# Altium schematic sheet ES2J1_Group9_Schematic.schdoc
size 297 x 209 mm; Symbol: Drawing-Symbol_A4; Company: 嘉立创EDA; Drawed: Boyu_Zhang_Bob; Reviewed: Boyu_Zhang_Bob; Part Number: u5617438; Version: V1.0; Page Size: A4; @Project Name: ES2J1_EEE; @Update Date: 2026-02-16; @Create Date: 2026-02-16; Device: Drawing-Symbol_A4; @Board Name: Board1; @Page Name: P1; @Create Time: 23:46:07; @Page Count: 1; @Page No: 1; @Schematic Name: Schematic1; @Update Time: 23:46:07; @Assembly Variant: Basic; Border: 1; Title Block Position: 3; Size: A4; Width: 1170; Height: 825; Region Start: 1; X Region Count: 6; Y Region Count: 4; Blade Width: 10; Title Block: 1; SheetNumber: 1; SheetTotal: 1
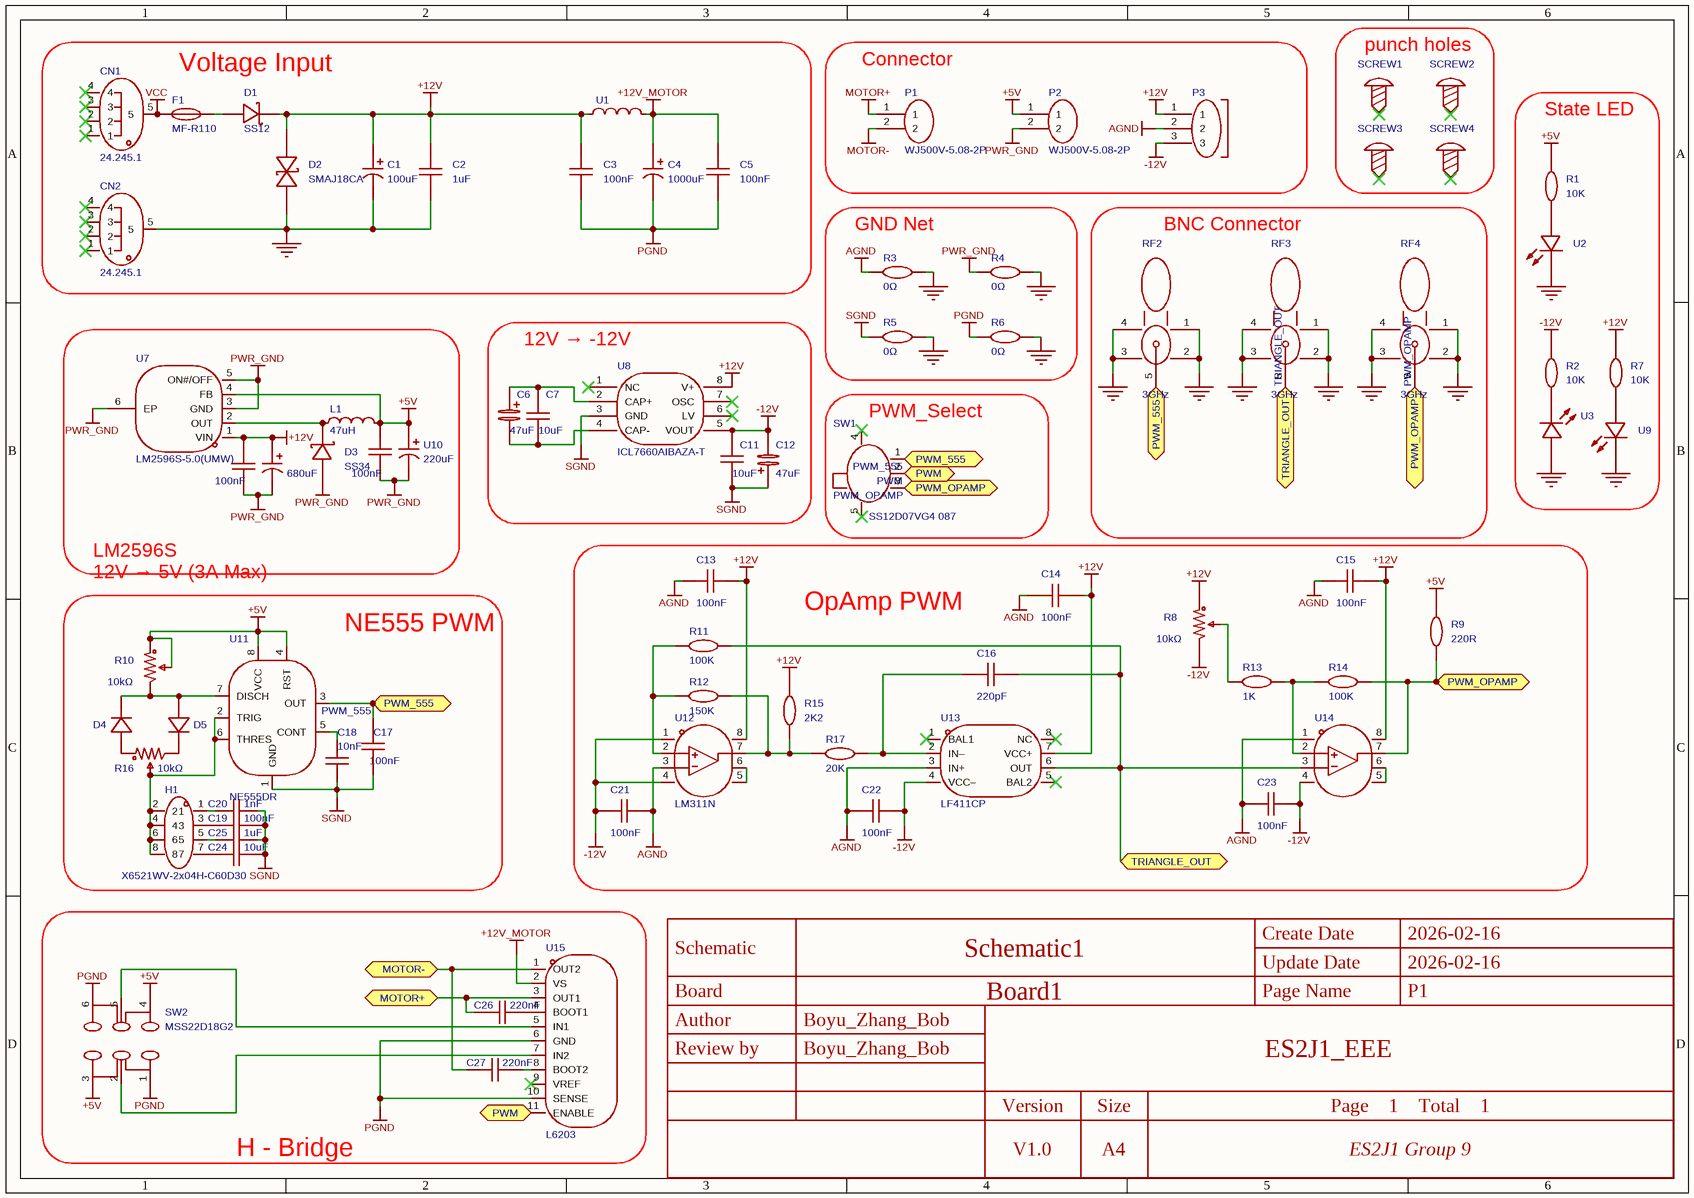
[diagram p0: ES2J1_Group9_Schematic.schdoc]

## Parts
C1  100uF  [CAP-TH_BD8.0-P3.50-D0.6-FD]
C2  1uF  [C1206]
C3  100nF  [C0805]
C4  1000uF  [CAP-TH_BD13.0-P5.00-D0.6-FD]
C5  100nF  [C0805]
C6  47uF  [CAP-SMD_L3.5-W2.8-R-RD]
C7  10uF  [C0603]
C8  100nF  [C0603]
C9  100nF  [C0603]
C10  680uF  [CAP-SMD_BD10.0-L10.3-W10.3-LS10.9-FD]
C11  10uF  [C0603]
C12  47uF  [CAP-SMD_L3.5-W2.8-R-RD]
C13  100nF  [C0603]
C14  100nF  [C0603]
C15  100nF  [C0603]
C16  220pF  [C0603]
C17  100nF  [C0603]
C18  10nF  [C0603]
C19  100nF  [C0603]
C20  1nF  [C0603]
C21  100nF  [C0603]
C22  100nF  [C0603]
C23  100nF  [C0603]
C24  10uF  [C0603]
C25  value 1uF  [C0603]
C26  220nF  [C0603]
C27  220nF  [C0603]
CN1  24.245.1  [ANT-TH_L33.0-W12.0_RED]
CN2  24.245.1  [ANT-TH_L33.0-W12.0_RED]
D1  SS12  [SMA_L4.3-W2.6-LS5.2-RD]
D2  SMAJ18CA  [SMA_L4.4-W2.6-LS5.0-BI]
D3  SS34  [SMA_L4.3-W2.6-LS5.2-RD]
D4  LL4148-MS  [LL-34_L3.5-W1.5-RD]  (value not drawn)
D5  LL4148-MS  [LL-34_L3.5-W1.5-RD]  (value not drawn)
F1  MF-R110  [FUSE-TH_L9.5-W3.5-P5.08-D0.8-S1.2]
H1  X6521WV-2x04H-C60D30  [HDR-TH_8P-P2.54-V-M-R2-C4-S2.54]
L1  47uH  [IND-SMD_L7.0-W6.6_FXL0630]
P1  WJ500V-5.08-2P  [CONN-TH_2P-P5.00_WJ500V-5.08-2P]
P2  WJ500V-5.08-2P  [CONN-TH_2P-P5.00_WJ500V-5.08-2P]
P3  WJ500V-5.08-03P-14-00A  [CONN-TH_3P-P5.00_WJ500V-5.08-3P]  (value not drawn)
R1  10K  [R0805]
R2  10K  [R0805]
R3  0Ω  [R0603]
R4  0Ω  [R0603]
R5  0Ω  [R0603]
R6  0Ω  [R0603]
R7  10K  [R0805]
R8  10kΩ  [RES-ADJ-TH_3P-L10.0-W10.0-P2.50-L]
R9  220R  [R0603]
R10  10kΩ  [RES-ADJ-TH_3P-L10.0-W10.0-P2.50-L]
R11  100K  [R0603]
R12  150K  [R0603]
R13  1K  [R0603]
R14  100K  [R0603]
R15  2K2  [R0603]
R16  10kΩ  [RES-ADJ-TH_3P-L10.0-W10.0-P2.50-L]
R17  20K  [R0603]
RF2  3GHz  [BNC-TH_DOSIN-801-0080]
RF3  3GHz  [BNC-TH_DOSIN-801-0080]
RF4  3GHz  [BNC-TH_DOSIN-801-0080]
SCREW1  (no value)  [M3螺丝]
SCREW2  (no value)  [M3螺丝]
SCREW3  (no value)  [M3螺丝]
SCREW4  (no value)  [M3螺丝]
SW1  SS12D07VG4 087  [SW-TH_SS12D07VG4]
SW2  MSS22D18G2  [SW-TH_MSS22D18GX]
U1  YI322513U300-3R0T  [L1210]  (value not drawn)
U2  204-10SDRD/S530-A3/F182-68  [LED-TH_BD4.0-P2.50-RD]  (value not drawn)
U3  204-10SDRD/S530-A3/F182-68  [LED-TH_BD4.0-P2.50-RD]  (value not drawn)
U7  LM2596S-5.0(UMW)  [TO-263-5_L10.2-W8.9-P1.70-BR]
U8  ICL7660AIBAZA-T  [SOIC-8_L5.0-W4.0-P1.27-LS6.0-BL]
U9  204-10SDRD/S530-A3/F182-68  [LED-TH_BD4.0-P2.50-RD]  (value not drawn)
U10  220uF  [CAP-SMD_BD10.0-L10.3-W10.3-LS11.3-FD]
U11  NE555DR  [SOIC-8_L4.9-W3.9-P1.27-LS6.0-BL]
U12  LM311N  [DIP-8_L9.8-W6.6-P2.54-LS7.6-BL]
U13  LF411CP  [PDIP-8_L9.3-W6.4-P2.54-LS7.9-BL-1]
U14  LM311N  [DIP-8_L9.8-W6.6-P2.54-LS7.6-BL]  (value not drawn)
U15  L6203  [MULTIWATT-11V_L19.6-W5.0-P1.70-L]

## Blocks framed on the sheet
Voltage Input: C1-C5 CN1 CN2 D1 D2 F1 U1
Connector: P1-P3
punch holes: SCREW1-SCREW4
State LED: R1 R2 R7 U2 U3 U9
GND Net: R3-R6
BNC Connector: RF2-RF4
12V → -12V: C6 C7 C11 C12 U8
PWM_Select: SW1
OpAmp PWM: C13-C16 C21-C23 R8 R9 R11-R15 R17 U12-U14
NE555 PWM: C17-C20 C24 C25 D4 D5 H1 R10 R16 U11
H - Bridge: C26 C27 SW2 U15

## Ports
MOTOR+ (bidir), MOTOR- (bidir), PWM (bidir, see ES2J1_Group9_Schematic[2D]), PWM (bidir, see ES2J1_Group9_Schematic[4B]), PWM_555 (bidir, see ES2J1_Group9_Schematic[2C], ES2J1_Group9_Schematic[4B]), PWM_555 (bidir, see ES2J1_Group9_Schematic[2C], ES2J1_Group9_Schematic[5B]), PWM_555 (bidir, see ES2J1_Group9_Schematic[4B], ES2J1_Group9_Schematic[5B]), PWM_OPAMP (bidir, see ES2J1_Group9_Schematic[4B], ES2J1_Group9_Schematic[6B]), PWM_OPAMP (bidir, see ES2J1_Group9_Schematic[4B], ES2J1_Group9_Schematic[6C]), PWM_OPAMP (bidir, see ES2J1_Group9_Schematic[6B], ES2J1_Group9_Schematic[6C]), TRIANGLE_OUT (bidir, see ES2J1_Group9_Schematic[4C]), TRIANGLE_OUT (bidir, see ES2J1_Group9_Schematic[5B])

## Nets
+5V: C8.2 L1.2 P2.1 R1.2 R9.1 R10.1 R10.2 SW2.3 SW2.4 U7.4(FB) U10.1 U11.4(RST) U11.8(VCC)
+12V: C1.1 C2.2 C3.2 C9.1 C10.1 C13.2 C14.2 C15.2 D1.1(K) D2.2 P3.1 R7.2 R8.1 R15.2 U1.1 U7.1(VIN) U8.8(V+) U12.8(VCC) U13.7(VCC+) U14.8(VCC)
+12V_MOTOR: C4.1 C5.2 U1.2 U15.2(VS)
-12V: C11.2 C12.2 C21.1 C22.2 C23.1 P3.3 R2.2 R8.3 U8.5(VOUT) U12.1(GND) U12.4(VEE) U13.4(VCC–) U14.4(VEE)
AGND: C13.1 C14.1 C15.1 C21.2 C22.1 C23.2 P3.2 R3.1 U12.3(IN-) U13.3(IN+) U14.1(GND)
GND: C1.2 C2.1 CN2.5 D2.1 R3.2 R4.2 R5.2 R6.2 RF2.1 RF2.2 RF2.3 RF2.4 RF3.1 RF3.2 RF3.3 RF3.4 RF4.1 RF4.2 RF4.3 RF4.4 U2.1(C) U3.2(A) U9.1(C)
MOTOR+: P1.1
MOTOR-: P1.2
PGND: C3.1 C4.2 C5.1 R6.1 SW2.1 SW2.6 U15.6(GND) U15.10(SENSE)
PWR_GND: C8.1 C9.2 C10.2 D3.2(A) P2.2 R4.1 U7.3(GND) U7.5(ON#/OFF) U7.6(EP) U10.2
SGND: C11.1 C12.1 C17.1 C18.1 C19.2 C20.2 C24.2 C25.2 R5.1 U8.3(GND) U11.1(GND)
VCC: CN1.5 F1.1
MOTOR+: C26.2 U15.3(OUT1) ; port MOTOR+  [a separate net that carries the same name]
MOTOR-: C27.2 U15.1(OUT2) ; port MOTOR-  [a separate net that carries the same name]
PWM: SW1.2 U15.11(ENABLE) ; port PWM
PWM_555: C17.2 RF2.5 SW1.1 U11.3(OUT) ; port PWM_555
PWM_OPAMP: R9.2 R14.1 RF4.5 SW1.3 U14.7(OUT) ; port PWM_OPAMP
TRIANGLE_OUT: C16.2 R11.1 RF3.5 U13.6(OUT) U14.3(IN-) ; port TRIANGLE_OUT
NetC6_1: C6.1 C7.2 U8.2(CAP+)
NetC6_2: C6.2 C7.1 U8.4(CAP-)
NetC16_1: C16.1 R17.1 U13.2(IN–)
NetC18_2: C18.2 U11.5(CONT)
NetC19_1: C19.1 H1.3
NetC20_1: C20.1 H1.1
NetC24_1: C24.1 H1.7
NetC25_1: C25.1 H1.5
NetC26_1: C26.1 U15.4(BOOT1)
NetC27_1: C27.1 U15.8(BOOT2)
NetD1_2: D1.2(A) F1.2
NetD3_1: D3.1(K) L1.1 U7.2(OUT)
NetD4_1: D4.1(K) D5.2(A) R10.3 U11.7(DISCH)
NetD4_2: D4.2(A) R16.1
NetD5_1: D5.1(K) R16.3
NetH1_2: H1.2 H1.4 H1.6 H1.8 R16.2 U11.2(TRIG) U11.6(THRES)
NetR1_1: R1.1 U2.2(A)
NetR2_1: R2.1 U3.1(C)
NetR7_1: R7.1 U9.2(A)
NetR8_2: R8.2 R13.2
NetR11_2: R11.2 R12.2 U12.2(IN+)
NetR12_1: R12.1 R15.1 R17.2 U12.7(OUT)
NetR13_1: R13.1 R14.2 U14.2(IN+)
NetSW2_2: SW2.2 U15.7(IN2)
NetSW2_5: SW2.5 U15.5(IN1)
NetU12_5: U12.5(BALANCE) U12.6(BALANCE/STROBE)
NetU14_5: U14.5(BALANCE) U14.6(BALANCE/STROBE)

Not connected (* = marked no-connect by the designer): CN1 1* 2* 3* 4*; CN2 1* 2* 3* 4*; SCREW1 1*; SCREW2 1*; SCREW3 1*; SCREW4 1*; SW1 4* 5*; U8 1(NC)* 6(LV)* 7(OSC)*; U13 1(BAL1)* 5(BAL2)* 8(NC)*; U15 9(VREF)*

## Notes on the sheet
- LM2596S
  12V → 5V (3A Max)
- Create Date
- 2026-02-16
- Schematic
- Board
- Schematic1
- Board1
- Update Date
- Page Name
- P1
- Author
- Review by
- Boyu_Zhang_Bob
- ES2J1_EEE
- Version
- V1.0
- Size
- A4
- Page    1    Total    1
- ES2J1 Group 9

## Library data of the parts
C1 = ECA1HHG101: 容值:100uF;精度:±20%;额定电压:50V;纹波电流:-;等效串联电阻(ESR):-;; Manufacturer: PANASONIC(松下); AddInBom: yes; ModelId: a2c936ec27754f809f3966430e36f767聨0819f05c4eef4c71ace90d822a990e87; ModelName: CAP-TH_D8.0-H8.0-P3.50; ModelTransform: 314.96,314.862,0,180,0,0,0,0,-137.795; Tolerance: ±20%; Voltage Rating: 50V; Pin Spacing: 3.5mm; Symbol: ECA1HHG101; Device: ECA1HHG101; LCSC Part Name: 100uF ±20% 50V; SupplierPart: C713160; ManufacturerPart: ECA1HHG101; Supplier Footprint: 插件,D8xL11.5mm; JLCPCB Part Class: Extended Part; Datasheet: https://item.szlcsc.com/datasheet/ECA1HHG101/753518.html; Supplier: LCSC; ConvertToPcb: yes; FootprintName: CAP-TH_BD8.0-P3.50-D0.6-FD; Value: 100uF; Ripple Current: -; Equivalent Series Resistance(ESR): -; Diameter: 8mm; Height - Seated (Max): 11.5mm; Lifetime: -
C2 = CL31B105KBHNNNE: 容值:1uF;精度:±10%;额定电压:50V;温度系数:X7R;; Manufacturer: SAMSUNG(三星); Add into BOM: yes; 3D Model: e4be705b945545a48e666415e3682bd8; 3D Model Transform: 125.984,62.992,0,0,0,0,0,0,0; Tolerance: ±10%; Voltage Rating: 50V; Temperature Coefficient: X7R; ModelName: C1206_L3.2-W1.6-H1.3; Symbol: CL31B105KBHNNNE; Device: CL31B105KBHNNNE; Convert to PCB: yes; Supplier Footprint: 1206; Value: 1uF; LCSC Part Name: 1uF ±10% 50V; Supplier Part: C1848; Manufacturer Part: CL31B105KBHNNNE; JLCPCB Part Class: Basic Part; Datasheet: https://item.szlcsc.com/datasheet/CL31B105KBHNNNE/2200.html; Supplier: LCSC; FootprintName: C1206
C3 C5 = CC0805KRX7R9BB104: 容值:100nF;精度:±10%;额定电压:50V;温度系数:X7R;; Manufacturer: YAGEO(国巨); Add into BOM: yes; 3D Model: 1ba041120af144c991958decab20d241; 3D Model Transform: 78.74,51.181,0,0,0,0,0,0.0005,0; Tolerance: ±10%; Voltage Rating: 50V; Temperature Coefficient: X7R; ModelName: C0805_L2.0-W1.3-H1.3; Symbol: CC0805KRX7R9BB104; Device: CC0805KRX7R9BB104; Convert to PCB: yes; Supplier Footprint: 0805; Value: 100nF; LCSC Part Name: 100nF ±10% 50V; Supplier Part: C49678; Manufacturer Part: CC0805KRX7R9BB104; JLCPCB Part Class: Basic Part; Datasheet: https://item.szlcsc.com/datasheet/CC0805KRX7R9BB104/50686.html; Supplier: LCSC; FootprintName: C0805
C4 = ERG50V1000M13X25: 容值:1000uF;精度:±20%;额定电压:50V;纹波电流:2.64A@100kHz;等效串联电阻(ESR):21mΩ@100kHz;; Manufacturer: JIERR(捷而瑞); AddInBom: yes; ModelId: d480d9258dff471ebe4ee69eb07122f6聨0819f05c4eef4c71ace90d822a990e87; ModelName: CAP-TH_BD13.0-P5.00-D1.2-FD; ModelTransform: 492.5187,492.025,0,0,0,0,-0.005,0,-137.795; Tolerance: ±20%; Voltage Rating: 50V; Pin Spacing: 5mm; Lifetime: 2000hrs@105℃; Symbol: ERG50V1000M13X25; Device: ERG50V1000M13X25; LCSC Part Name: 1000uF ±20% 50V; SupplierPart: C47344169; ManufacturerPart: ERG50V1000M13X25; Supplier Footprint: 插件,D13xL25mm; JLCPCB Part Class: Extended Part; Datasheet: https://item.szlcsc.com/datasheet/ERG50V1000M13X25/49556610.html; Supplier: LCSC; ConvertToPcb: yes; FootprintName: CAP-TH_BD13.0-P5.00-D0.6-FD; Value: 1000uF; Ripple Current: 2.64A@100kHz; Equivalent Series Resistance(ESR): 21mΩ@100kHz; Diameter: 13mm; Height - Seated (Max): 25mm; Operating Temperature: -40℃~+105℃
C6 C12 = CA45-B-16V-47uF-K: 容值:47uF;精度:±10%;额定电压:16V;等效串联电阻(ESR):3Ω@100kHz;; Manufacturer: CEC(振华新云); AddInBom: yes; ModelId: 0dfcda272f9b43668c6086d3a08712ba聨0819f05c4eef4c71ace90d822a990e87; ModelName: CASE-B_L3.5-W2.8-H1.9; ModelTransform: 145.669,110.236,0,180,0,0,0,0,0; Tolerance: ±10%; Voltage Rating: 16V; Symbol: CA45-B-16V-47UF-K; Device: CA45-B-16V-47uF-K; LCSC Part Name: 47uF ±10% 16V; SupplierPart: C136751; ManufacturerPart: CA45-B-16V-47uF-K; Supplier Footprint: CASE-B-3528-19(mm); JLCPCB Part Class: Extended Part; Datasheet: https://item.szlcsc.com/datasheet/CA45-B-16V-47uF-K/148067.html; Supplier: LCSC; ConvertToPcb: yes; FootprintName: CAP-SMD_L3.5-W2.8-R-RD; Value: 47uF; Equivalent Series Resistance(ESR): 3Ω@100kHz; Operating Temperature: -55℃~+125℃
C7 = CAP_0603: Symbol: CapAcitance; ConvertToPcb: yes; ModelId: ac125912035d415993ca9572d50418b1聨0819f05c4eef4c71ace90d822a990e87; ModelName: C0603_L1.6-W0.8-H0.8; ModelTransform: 62.992,31.496,0,0,0,0,0,0,0; Device: CAP_0603; Value: 10uF; AddInBom: yes; Supplier Footprint: 0603; FootprintName: C0603
C8 C9 = CAP_0603: Symbol: CapAcitance; 3D Model: ac125912035d415993ca9572d50418b1; 3D Model Transform: 62.992,31.496,0,0,0,0,0,0,0; ConvertToPcb: yes; ModelName: C0603_L1.6-W0.8-H0.8; Device: CAP_0603; Supplier Footprint: 0603; Value: 100nF; AddInBom: yes; FootprintName: C0603
C10 = GVM1V681M1010: 容值:680uF;精度:±20%;额定电压:35V;纹波电流:1.19A@120Hz;等效串联电阻:60mΩ@120Hz;; Manufacturer: HONOR(荣誉); 3D Model: f51b16cd856a4d95baa34e209816f37c; 3D Model Transform: 429.133,405.511,0,0,0,0,0,0,0; Tolerance: ±20%; Rated Voltage: 35V; φD: 10mm; L: 10.2mm; Lifetime @ Temp: 5000hrs@105℃; AddInBom: yes; Symbol: GVM1V681M1010; Device: GVM1V681M1010; LCSC Part Name: 680uF ±20% 35V; Supplier Part: C2980172; Manufacturer Part: GVM1V681M1010; Supplier Footprint: SMD,D10xL10.5mm; Datasheet: https://atta.szlcsc.com/upload/public/pdf/source/20220509/EB2A569F0F3393644DE07704993C28AA.pdf; Supplier: LCSC; Value: 680uF; Ripple Current: 1.19A@120Hz; Equivalent Series Resistance(ESR): 60mΩ@120Hz; Operating Temperature: -55℃~+105℃; ConvertToPcb: yes; FootprintName: CAP-SMD_BD10.0-L10.3-W10.3-LS10.9-FD; ModelName: CAP-SMD_BD10.0-L10.3-W10.3-LS10.9-FD
C11 = CAP_0603: Symbol: CapAcitance; 3D Model: ac125912035d415993ca9572d50418b1聨0819f05c4eef4c71ace90d822a990e87; 3D Model Transform: 62.992,31.496,0,0,0,0,0,0,0; ConvertToPcb: yes; ModelName: C0603_L1.6-W0.8-H0.8; Device: CAP_0603; Supplier Footprint: 0603; Value: 10uF; AddInBom: yes; FootprintName: C0603
C13-C16 C21-C23 C26 C27 = CAP_0603: Symbol: Capacitance; 3D Model: ac125912035d415993ca9572d50418b1聨0819f05c4eef4c71ace90d822a990e87; 3D Model Transform: 62.992,31.496,0,0,0,0,0,0,0; ConvertToPcb: yes; ModelName: C0603_L1.6-W0.8-H0.8; Device: CAP_0603; Supplier Footprint: 0603; AddInBom: yes; FootprintName: C0603
  C13-C15 C21-C23: Value: 100nF
  C16: Value: 220pF
  C26 C27: Value: 220nF
C17 C19 = CC0603KRX7R9BB104: 容值:100nF;精度:±10%;额定电压:50V;材质(温度系数):X7R;; Manufacturer: YAGEO(国巨); 3D Model: ac125912035d415993ca9572d50418b1; 3D Model Transform: 62.992,31.496,0,0,0,0,0,0,0; Tolerance: ±10%; Voltage Rated: 50V; Temperature Coefficient: X7R; AddInBom: yes; ModelName: C0603_L1.6-W0.8-H0.8; Symbol: CC0603KRX7R9BB104; Device: CC0603KRX7R9BB104; Value: 100nF; LCSC Part Name: 100nF ±10% 50V; Supplier Part: C14663; Manufacturer Part: CC0603KRX7R9BB104; Supplier Footprint: 0603; JLCPCB Part Class: Basic Part; Datasheet: https://atta.szlcsc.com/upload/public/pdf/source/20170116/1484561234239.pdf; Supplier: LCSC; ConvertToPcb: yes; FootprintName: C0603
C18 = CL10B103KB8NNNC: 容值:10nF;精度:±10%;额定电压:50V;材质(温度系数):X7R;; Manufacturer: SAMSUNG(三星); 3D Model: ac125912035d415993ca9572d50418b1; 3D Model Transform: 62.992,31.496,0,0,0,0,0,0,0; Tolerance: ±10%; Voltage Rated: 50V; Temperature Coefficient: X7R; AddInBom: yes; ModelName: C0603_L1.6-W0.8-H0.8; Symbol: CL10B103KB8NNNC; Device: CL10B103KB8NNNC; Value: 10nF; LCSC Part Name: 10nF ±10% 50V; Supplier Part: C1589; Manufacturer Part: CL10B103KB8NNNC; Supplier Footprint: 0603; JLCPCB Part Class: Extended Part; Datasheet: https://atta.szlcsc.com/upload/public/pdf/source/20160103/1457707680084.pdf; Supplier: LCSC; ConvertToPcb: yes; FootprintName: C0603
C20 = CL10B102KB8NNNC: 容值:1nF;精度:±10%;额定电压:50V;材质(温度系数):X7R;; Manufacturer: SAMSUNG(三星); 3D Model: ac125912035d415993ca9572d50418b1; 3D Model Transform: 62.992,31.496,0,0,0,0,0,0,0; Tolerance: ±10%; Voltage Rated: 50V; Temperature Coefficient: X7R; AddInBom: yes; ModelName: C0603_L1.6-W0.8-H0.8; Symbol: CL10B102KB8NNNC; Device: CL10B102KB8NNNC; Value: 1nF; LCSC Part Name: 1nF ±10% 50V; Supplier Part: C1588; Manufacturer Part: CL10B102KB8NNNC; Supplier Footprint: 0603; JLCPCB Part Class: Basic Part; Datasheet: https://atta.szlcsc.com/upload/public/pdf/source/20160103/1457707679526.pdf; Supplier: LCSC; ConvertToPcb: yes; FootprintName: C0603
C24 = CL10A106MA8NRNC: 容值:10uF;精度:±20%;额定电压:25V;温度系数:X5R;; Manufacturer: SAMSUNG(三星); 3D Model: ac125912035d415993ca9572d50418b1; 3D Model Transform: 62.992,31.496,0,0,0,0,0,0,0; Tolerance: ±20%; Voltage Rated: 25V; Temperature Coefficient: X5R; AddInBom: yes; ModelName: C0603_L1.6-W0.8-H0.8; Symbol: CL10A106MA8NRNC; Device: CL10A106MA8NRNC; Value: 10uF; LCSC Part Name: 10uF ±20% 25V; Supplier Part: C96446; Manufacturer Part: CL10A106MA8NRNC; Supplier Footprint: 0603; JLCPCB Part Class: Basic Part; Datasheet: https://atta.szlcsc.com/upload/public/pdf/source/20170325/1490427913016.pdf; Supplier: LCSC; ConvertToPcb: yes; FootprintName: C0603
C25 = CL10A105KB8NNNC: 温度系数:X5R;精度:±10%;额定电压:50V;容值:1uF;; Manufacturer: SAMSUNG(三星); 3D Model: ac125912035d415993ca9572d50418b1; 3D Model Transform: 62.992,31.496,0,0,0,0,0,0,0; Temperature Coefficient: X5R; Tolerance: ±10%; Voltage Rated: 50V; AddInBom: yes; ModelName: C0603_L1.6-W0.8-H0.8; Symbol: CL10A105KB8NNNC; Device: CL10A105KB8NNNC; LCSC Part Name: 1uF(105) ±10% 50V; Supplier Part: C15849; Manufacturer Part: CL10A105KB8NNNC; Supplier Footprint: 0603; JLCPCB Part Class: Basic Part; Datasheet: https://atta.szlcsc.com/upload/public/pdf/source/20160103/1457707679084.pdf; Supplier: LCSC; ConvertToPcb: yes; FootprintName: C0603
CN1 CN2 = 24.245.1: 连接器类型:接线柱;; Manufacturer: AMASS(艾迈斯); 3D Model: 30aa4667946547798146a4b66efef111聨0819f05c4eef4c71ace90d822a990e87; 3D Model Transform: 1299.21,472.8337,0,0,0,0,-382.283,0,-102.362; Connector Type: 接线柱; Voltage Rating: 1kV; Current Rating: 24A; AddInBom: yes; Symbol: 24.245.1; Device: 24.245.1; LCSC Part Name: 接线柱; Supplier Part: C7437326; Manufacturer Part: 24.245.1; Supplier Footprint: 插件; JLCPCB Part Class: Extended Part; Datasheet: https://item.szlcsc.com/datasheet/24.245.1/8459551.html; Supplier: LCSC; ConvertToPcb: yes; FootprintName: ANT-TH_L33.0-W12.0_RED; ModelName: ANT-TH_L33.0-W12.0_RED
D1 = SS12: 正向压降(Vf):550mV@1A;直流反向耐压(Vr):20V;整流电流:1A;; Manufacturer: YANGJIE(扬杰); Symbol: SS12_C211768; AddInBom: yes; ModelId: e3551acb3c5a4975a5e9d36087fe1fa2聨0819f05c4eef4c71ace90d822a990e87; ModelTransform: 185.039,102.362,0,0,0,0,0,0,0; Voltage - DC Reverse(Vr): 20V; Current - Rectified: 1A; Reverse Leakage Current (Ir): 500uA@20V; Operating Junction Temperature Range: -55℃~+125℃; Non-Repetitive Peak Forward Surge Current: 30A; Device: SS12; LCSC Part Name: 电压:20V 电流:1A; SupplierPart: C211768; ManufacturerPart: SS12; Supplier Footprint: SMA-W; JLCPCB Part Class: Extended Part; Datasheet: https://item.szlcsc.com/datasheet/SS12/212743.html; Supplier: LCSC; ConvertToPcb: yes; FootprintName: SMA_L4.3-W2.6-LS5.2-RD; ModelName: SMA_L4.3-W2.6-LS5.2-RD; Voltage - Forward(Vf@If): 550mV@1A
D2 = SMAJ18CA_C151240: 极性:双向;反向截止电压(Vrwm):18V;钳位电压:29.2V;峰值脉冲电流(Ipp):13.7A@10/1000us;峰值脉冲功率(Ppp):400W@10/1000us;击穿电压:22.1V;; Manufacturer: Littelfuse(美国力特); AddInBom: yes; ModelId: 88a0b00993434c679979bf3235683172聨0819f05c4eef4c71ace90d822a990e87; ModelName: SMA_L4.3-W2.5-H2.1-LS5.0; ModelTransform: 204.724,98.425,0,0,0,0,0,0,0; Polarity: 双向; Reverse Stand-Off Voltage (Vrwm): 18V; Clamping Voltage: 29.2V; Voltage - Breakdown: 22.1V; Reverse Leakage Current (Ir): 1uA; level of protection: IEC 61000-4-4；IEC 61000-4-2; Type: TVS; Symbol: SMAJ18CA_C151240; Device: SMAJ18CA_C151240; LCSC Part Name: 双向TVS 18V截止 峰值脉冲电流：13.7A@10/1000us; SupplierPart: C151240; ManufacturerPart: SMAJ18CA; Supplier Footprint: DO-214AC(SMA); JLCPCB Part Class: Extended Part; Datasheet: https://item.szlcsc.com/datasheet/SMAJ18CA/162580.html; Supplier: LCSC; ConvertToPcb: yes; FootprintName: SMA_L4.4-W2.6-LS5.0-BI; Peak Pulse Current (Ipp): 13.7A@10/1000us; Peak Pulse Power Dissipation (Ppp): 400W@10/1000us; Operating Temperature: -65℃~+150℃
D3 = SS34_C8678: 二极管配置:独立式;正向压降(Vf):550mV@3A;直流反向耐压(Vr):40V;整流电流:3A;; Manufacturer: MDD(辰达半导体); AddInBom: yes; ModelId: e3551acb3c5a4975a5e9d36087fe1fa2聨0819f05c4eef4c71ace90d822a990e87; ModelTransform: 185.039,102.362,0,0,0,0,0,0,0; Diode Configuration: 独立式; Voltage - DC Reverse(Vr): 40V; Current - Rectified: 3A; Reverse Leakage Current (Ir): 500uA@40V; Operating Junction Temperature Range: -55℃~+125℃; Symbol: SS34_C8678; Device: SS34_C8678; LCSC Part Name: 电压:40V 电流:3A; SupplierPart: C8678; ManufacturerPart: SS34; Supplier Footprint: SMA(DO-214AC); JLCPCB Part Class: Basic Part; Datasheet: https://item.szlcsc.com/datasheet/SS34/9178.html; Supplier: LCSC; ConvertToPcb: yes; FootprintName: SMA_L4.3-W2.6-LS5.2-RD; ModelName: SMA_L4.3-W2.6-LS5.2-RD; Voltage - Forward(Vf@If): 550mV@3A
D4 D5 = LL4148-MS: 二极管配置:-;功率:500mW;直流反向耐压(Vr):75V;平均整流电流(Io):200mA;正向压降(Vf):1V@10mA;反向电流(Ir):5uA@75V;反向恢复时间(trr):4ns;工作温度:+175@(Tj);; Manufacturer: MSKSEMI(美森科); 3D Model: 4a6f2309ca4c4217857da1816cccdf69; 3D Model Transform: 133.9,59,0,0,0,0,0,0,0; Power Dissipation: 500mW; Reverse Voltage (Vr): 75V; Average Rectified Current (Io): 200mA; Reverse Recovery Time (trr): 4ns; AddInBom: yes; ModelName: LL-34_L3.5-W1.5; Symbol: LL4148-MS; Device: LL4148-MS; Operating Temperature: +175@(Tj); LCSC Part Name: 75V 200mA 4ns; Supplier Part: C2847029; Manufacturer Part: LL4148-MS; Supplier Footprint: LL-34; JLCPCB Part Class: Extended Part; Datasheet: https://atta.szlcsc.com/upload/public/pdf/source/20210830/13C8DBA5F58A6318A7363B9E0C625E74.pdf; Supplier: LCSC; Diode Configuration: -; Forward Voltage (Vf@If): 1V@10mA; Reverse Leakage Current: 5uA@75V; ConvertToPcb: yes; FootprintName: LL-34_L3.5-W1.5-RD
F1 = MF-R110: 耐压(Vmax):30V;最大电流(Imax):40A;保持电流(Ihold):1.1A;跳闸电流(Itrip):2.2A;; Manufacturer: BOURNS; AddInBom: yes; ModelId: 44e4b54e31744074ab134cbc996097b5聨0819f05c4eef4c71ace90d822a990e87; ModelName: FUSE-TH_L9.5-W3.5-H16.0-P5.1-D0.8-S1.2; ModelTransform: 374.01406,137.795,0,0,0,0,0,0,-275.591; Voltage - Max: 30V; Current - Max: 40A; Hold Current: 1.1A; Trip Current: 2.2A; Power Dissipation: 700mW; Resistance - Initial (Ri) (Min): 100mΩ; Resistance - Post Trip (R1) (Max): 270mΩ; Time to Trip(Max): 6.6s; Symbol: MF-R110; Device: MF-R110; LCSC Part Name: 30V 40A 跳闸电流2.2A; SupplierPart: C208481; ManufacturerPart: MF-R110; Supplier Footprint: 插件,P=5.08mm; JLCPCB Part Class: Extended Part; Datasheet: https://item.szlcsc.com/datasheet/MF-R110/209502.html; Supplier: LCSC; ConvertToPcb: yes; FootprintName: FUSE-TH_L9.5-W3.5-P5.08-D0.8-S1.2; Operating Temperature: -40℃~+85℃; Length: 8.9mm; Width: -; Height: -; Pitch: -
H1 = X6521WV-2x04H-C60D30: 插针结构:2x4P;间距:2.54mm;行距:2.54mm;圆针/方针:方针;排数:双排;总PIN位数:8P;额定电流:3A;额定电压:250V;配合针长度:-;塑高:2.5mm;端接针长度:-;触头材质:黄铜;触头镀层:金;工作温度:-40℃~+105℃;颜色:黑色;; Manufacturer: XKB Connection(中国星坤); Symbol: X6521WV-2×04H-C30D60; AddInBom: yes; ModelId: 9655140a9899454ea9d6a6732d55fb0e聨0819f05c4eef4c71ace90d822a990e87; ModelName: HDR-TH_8P-P2.54-M-LI-2X4P; ModelTransform: 399.999,200,0,0,0,0,0,0,-118.11; Pin Structure: 2x4P; Pitch: 2.54mm; Circluar Pins/Square Pins: 方针; Current Rating: 3A; Voltage Rating (Max): 250V; Device: X6521WV-2x04H-C60D30; LCSC Part Name: 2x4P 间距:2.54mm 方针; SupplierPart: C706894; ManufacturerPart: X6521WV-2x04H-C60D30; Supplier Footprint: 插件,P=2.54mm; JLCPCB Part Class: Extended Part; Datasheet: https://item.szlcsc.com/datasheet/X6521WV-2x04H-C60D30/744016.html; Supplier: LCSC; ConvertToPcb: yes; FootprintName: HDR-TH_8P-P2.54-V-M-R2-C4-S2.54; Row Spacing: 2.54mm; Number of Rows: 双排; Number of Pins: 8P; Length of Mating Pin: -; Insulation Height: 2.5mm; Length of End Connection Pin: -; Contact Material: 黄铜; Contact Plating: 金; Operating Temperature: -40℃~+105℃; Color: 黑色
L1 = FXL0630-470-M: 电感值:47uH;精度:±20%;额定电流:1.5A;饱和电流(Isat):2A;类型:一体成型电感;; Manufacturer: cjiang(长江微电); 3D Model: 6712504104d74f0ca01cd7d0df9965b7; 3D Model Transform: 275.59,259.842,0,0,0,0,0,0,0; Tolerance: ±20%; Rated Current: 1.5A; Saturation Current (Isat): 2A; DC Resistance (DCR): 385mΩ; Type: 一体成型电感; AddInBom: yes; ModelName: IND-SMD_L7.0-W6.6-H2.8_FXL0630; Symbol: FXL0630-470-M; Device: FXL0630-470-M; LCSC Part Name: 47uH ±20% 2A; Supplier Part: C475913; Manufacturer Part: FXL0630-470-M; Supplier Footprint: SMD,6.6x7mm; JLCPCB Part Class: 扩展库; Datasheet: https://atta.szlcsc.com/upload/public/pdf/source/20240426/3189EA8206330E2108542F9E34E540E7.pdf; Supplier: LCSC; Value: 47uH; ConvertToPcb: yes; FootprintName: IND-SMD_L7.0-W6.6_FXL0630
P1 = WJ500V-5.08-2P: 结构:1x2P;间距:5.08mm;颜色:绿色;安装方式:直插;额定电流:18A;额定电压:250V;排数:1;线规 - AWG:14~30;线规 - 平方毫米:2.5;每排PIN数:2;触头材质:-;触头镀层:-;工作温度范围:-40℃~+105℃;焊接温度(最大值):-;; Manufacturer: KANGNEX(康奈克斯电气); Symbol: WJ500V-5.08-2P-14-00A; 3D Model: 0f4a503c8d3b4ae19ed61267f5e9a1d7聨0819f05c4eef4c71ace90d822a990e87; 3D Model Transform: 423.621,393.7,0,0,0,0,-11.811,19.685,-137.795; Structure: 1x2P; Pitch: 5.08mm; Current Rating (Max): 18A; Voltage Rating (Max): 250V; Wire Gauge - AWG: 14~30; Wire Gauge - mm2: 2.5; Number of PINs Per Row: 2; Screw Specification: M2.5; AddInBom: yes; Device: WJ500V-5.08-2P; LCSC Part Name: 1x2P 5.08mm 直插 排数:1 每排P数:2; Supplier Part: C8465; Manufacturer Part: WJ500V-5.08-2P; Supplier Footprint: 插件,P=5.08mm; JLCPCB Part Class: Extended Part; Datasheet: https://atta.szlcsc.com/upload/public/pdf/source/20191225/C8465_02D34CE5B5B4A53DF5891601D97FA9F4.pdf; Supplier: LCSC; Color: 绿色; Mounting Style: 直插; Number of Pins: 2P; Number of Rows: 1; Contact Material: -; Contact Plating: -; Operating Temperature Range: -40℃~+105℃; Soldering Temperature(Max): -; ConvertToPcb: yes; FootprintName: CONN-TH_2P-P5.00_WJ500V-5.08-2P; ModelName: CONN-TH_2P-P5.00_WJ500V-5.08-2P
P2 = WJ500V-5.08-2P: 结构:1x2P;间距:5.08mm;颜色:绿色;安装方式:直插;额定电流:18A;额定电压:250V;排数:1;线规 - AWG:14~30;线规 - 平方毫米:2.5;每排PIN数:2;触头材质:-;触头镀层:-;工作温度范围:-40℃~+105℃;焊接温度(最大值):-;; Manufacturer: KANGNEX(康奈克斯电气); Symbol: WJ500V-5.08-2P-14-00A; AddInBom: yes; ModelId: 0f4a503c8d3b4ae19ed61267f5e9a1d7聨0819f05c4eef4c71ace90d822a990e87; ModelTransform: 423.621,393.7,0,0,0,0,-11.811,19.685,-137.795; Structure: 1x2P; Pitch: 5.08mm; Current Rating (Max): 18A; Voltage Rating (Max): 250V; Wire Gauge - AWG: 14~30; Wire Gauge - mm2: 2.5; Number of PINs Per Row: 2; Screw Specification: M2.5; Device: WJ500V-5.08-2P; LCSC Part Name: 1x2P 5.08mm 直插 排数:1 每排P数:2; SupplierPart: C8465; ManufacturerPart: WJ500V-5.08-2P; Supplier Footprint: 插件,P=5.08mm; JLCPCB Part Class: Extended Part; Datasheet: https://atta.szlcsc.com/upload/public/pdf/source/20191225/C8465_02D34CE5B5B4A53DF5891601D97FA9F4.pdf; Supplier: LCSC; ConvertToPcb: yes; FootprintName: CONN-TH_2P-P5.00_WJ500V-5.08-2P; ModelName: CONN-TH_2P-P5.00_WJ500V-5.08-2P; Color: 绿色; Mounting Style: 直插; Number of Pins: 2P; Number of Rows: 1; Contact Material: -; Contact Plating: -; Operating Temperature Range: -40℃~+105℃; Soldering Temperature(Max): -
P3 = WJ500V-5.08-03P-14-00A: 结构:1x3P;间距:5.08mm;颜色:绿色;安装方式:直插;排数:1;每排PIN数:3;额定电流:18A;额定电压:250V;线规 - AWG:14~30;线规 - 平方毫米:2.5;工作温度:-40℃~+105℃;; Manufacturer: KANGNEX(康奈克斯电气); Symbol: WJ500V-5.08-3P-14-00A; 3D Model: f80d5090781743d49abcb05979f5618f聨0819f05c4eef4c71ace90d822a990e87; 3D Model Transform: 623.621,393.7,0,0,0,0,11.811,-20.315,-177.165; Number of Positions or Pins: 1x3P; Pitch: 5.08mm; Number of PINs Per Row: 3; Current Rating: 18A; Voltage Rating (Max): 250V; Wire Gauge - AWG: 14~30; Wire Gauge - mm2: 2.5; AddInBom: yes; Device: WJ500V-5.08-03P-14-00A; LCSC Part Name: 5.08mm 1x3P 排数:1 每排P数:3 直插; Supplier Part: C72334; Manufacturer Part: WJ500V-5.08-03P-14-00A; Supplier Footprint: 插件,P=5.08mm; JLCPCB Part Class: Extended Part; Datasheet: https://item.szlcsc.com/datasheet/WJ500V-5.08-03P-14-00A/73443.html; Supplier: LCSC; Color: 绿色; Mounting Type: 直插; Number of Pins: 3P; Number of Rows: 1; Operating Temperature: -40℃~+105℃; ConvertToPcb: yes; FootprintName: CONN-TH_3P-P5.00_WJ500V-5.08-3P; ModelName: CONN-TH_3P-P5.00_WJ500V-5.08-3P
R1 R2 R7 = Res_0805: Symbol: 电阻; 3D Model: 37a81e68749a4138bd2dfa6897b24b85聨0819f05c4eef4c71ace90d822a990e87; 3D Model Transform: 78.74,51.181,0,0,0,0,0,-0.0005,0; ConvertToPcb: yes; ModelName: R0805_L2.0-W1.3-H0.6; Device: Res_0805; Supplier Footprint: 0805; Value: 10K; AddInBom: yes; FootprintName: R0805
R3-R6 R9 R11-R15 R17 = Res_0603: Symbol: 电阻; 3D Model: fc143cca1e79419f9cd78b61e9279f08聨0819f05c4eef4c71ace90d822a990e87; 3D Model Transform: 31.8897,63.7794,0,90,0,0,0,0,0; ConvertToPcb: yes; Device: Res_0603; Supplier Footprint: 0603; AddInBom: yes; FootprintName: R0603; ModelName: R0603
  R3-R6: Value: 0Ω
  R9: Value: 220R
  R11 R14: Value: 100K
  R12: Value: 150K
  R13: Value: 1K
  R15: Value: 2K2
  R17: Value: 20K
R8 R10 R16 = 3296W-1-103: 阻值:10kΩ;精度:±10%;温度系数:±250ppm/;; Manufacturer: BOCHEN(博晨); 3D Model: b182808559bb43bda9e7de64b64134cb; 3D Model Transform: 374,189,0,180,0,0,0,0,-137.8; Tolerance: ±10%; AddInBom: yes; ModelName: 3296W; Symbol: 3296W-1-103; Device: 3296W-1-103; Value: 10kΩ; Temperature Coefficient: ±250ppm/; LCSC Part Name: 10kΩ ±10%; Supplier Part: C118954; Manufacturer Part: 3296W-1-103; Supplier Footprint: 插件; JLCPCB Part Class: Extended Part; Datasheet: https://atta.szlcsc.com/upload/public/pdf/source/20171114/C118954_15106326646611117443.pdf; Supplier: LCSC; ConvertToPcb: yes; FootprintName: RES-ADJ-TH_3P-L10.0-W10.0-P2.50-L
RF2-RF4 = DOSIN-801-0080: 连接器类型:板端;接口类型:-;端口数量:1;接口直径:9.6mm;接口长度/高度:-;频率:3GHz;射频系列:BNC;阻抗:50Ω;样式:弯头;工作温度:-55℃~+155℃;; Manufacturer: dosinconn(德索五金); AddInBom: yes; ModelId: 75cabd077e5445f6b96c05c495e45496聨0819f05c4eef4c71ace90d822a990e87; ModelTransform: 545.56985,1192.91096,0,0,0,0,0,401.575,-153.543; Connector Type: 板端; Number of Ports: 1; Interface Diameter: 9.6mm; RF Series: BNC; Impedance: 50Ω; Style: 弯头; Symbol: DOSIN-801-0080; Device: DOSIN-801-0080; LCSC Part Name: 三件套 BNC 弯头; SupplierPart: C521219; ManufacturerPart: DOSIN-801-0080; Supplier Footprint: 插件; JLCPCB Part Class: Extended Part; Datasheet: https://item.szlcsc.com/datasheet/DOSIN-801-0080/538216.html; Supplier: LCSC; ConvertToPcb: yes; FootprintName: BNC-TH_DOSIN-801-0080; ModelName: BNC-TH_DOSIN-801-0080; Interface: -; Interface Length/Height: -; Value: 3GHz; Operating Temperature Range: -55℃~+155℃
SCREW1-SCREW4 = M3螺丝: Symbol: 螺丝孔; ConvertToPcb: yes; Device: M3螺丝; AddInBom: yes; Supplier Footprint: 插件; FootprintName: M3螺丝
SW1 = SS12D07VG4 087: 电路结构:单刀双掷;安装方式:直插;开关颜色:-;额定电流:500mA;额定电压:50V;工作寿命:5千次;; Manufacturer: SHOU HAN(首韩); AddInBom: yes; ModelId: 8e9c0e123f4944c8b06c415643703e37聨0819f05c4eef4c71ace90d822a990e87; ModelTransform: 346.456,181.102,0,180,0,0,0,0,-110.236; Circuit: 单刀双掷; Switch Height: 4.7mm; Current Rating: 500mA; Voltage Rating: 50V; Life: 5千次; Symbol: SS12D07VG4 087; Device: SS12D07VG4 087; LCSC Part Name: SS12D07VG4; SupplierPart: C2939726; ManufacturerPart: SS12D07VG4 087; Supplier Footprint: 插件,8.7x4.4mm; JLCPCB Part Class: Extended Part; Datasheet: https://item.szlcsc.com/datasheet/SS12D07VG4%2520087/3301205.html; Supplier: LCSC; ConvertToPcb: yes; FootprintName: SW-TH_SS12D07VG4; ModelName: SW-TH_SS12D07VG4; Actuator Style: -; Termination Style: PC引脚; Length: 8.7mm; Width: 4.4mm; Mounting Type: 直插; Actuator Color: -; Operating Temperature: -10℃~+50℃
SW2 = MSS22D18G2: 电路结构:双刀双掷;安装方式:直插;开关颜色:-;额定电流:100mA;额定电压:12V;工作寿命:1万次;; Manufacturer: SHOU HAN(首韩); AddInBom: yes; ModelId: 4e79911c472245beb5c9689c86985599聨0819f05c4eef4c71ace90d822a990e87; ModelTransform: 358.267,145.669,0,180,0,0,0,-1.929,-125.984; Circuit: 双刀双掷; Switch Height: 3.5mm; Current Rating: 100mA; Voltage Rating: 12V; Life: 1万次; Symbol: MSS22D18G2; Device: MSS22D18G2; LCSC Part Name: MSS-22D18G2; SupplierPart: C431542; ManufacturerPart: MSS22D18G2; Supplier Footprint: 插件-6P,9.1x3.5mm; JLCPCB Part Class: Extended Part; Datasheet: https://item.szlcsc.com/datasheet/MSS22D18G2/427899.html; Supplier: LCSC; ConvertToPcb: yes; FootprintName: SW-TH_MSS22D18GX; ModelName: SW-TH_MSS22D18GX; Actuator Style: -; Termination Style: SMD接片; Length: 9.1mm; Width: 3.5mm; Mounting Type: 直插; Actuator Color: -; Operating Temperature: -10℃~+50℃
U1 = YI322513U300-3R0T: 阻抗@频率:30Ω@100MHz;误差:±25%;直流电阻(DCR):50mΩ;; Manufacturer: YJYCOIN(益嘉源); 3D Model: d344e8280e7a45c09c747bfa1809b75c聨0819f05c4eef4c71ace90d822a990e87; 3D Model Transform: 125.984,98.425,0,0,0,0,0,0,0; Tolerance: ±25%; DC Resistance(DCR): 50mΩ; Current Rating: 3A; Number of Circuits: 1; AddInBom: yes; Symbol: YI322513U300-3R0T; Device: YI322513U300-3R0T; LCSC Part Name: 单路 1210磁珠 阻抗30Ω@100MHz; Supplier Part: C3033923; Manufacturer Part: YI322513U300-3R0T; Supplier Footprint: 1210; JLCPCB Part Class: Extended Part; Datasheet: https://item.szlcsc.com/datasheet/YI322513U300-3R0T/3577229.html; Supplier: LCSC; Impedance @ Frequency: 30Ω@100MHz; Operating Temperature: -40℃~+125℃; ConvertToPcb: yes; FootprintName: L1210; ModelName: L1210
U2 U3 U9 = 204-10SDRD/S530-A3/F182-68: -; Manufacturer: EVERLIGHT(亿光); AddInBom: yes; ModelId: 8e04cf257f6f425a9619e557bdb7ad57聨0819f05c4eef4c71ace90d822a990e87; ModelName: LED-TH_BD4.0-P2.50-H6.0-RD; ModelTransform: 169.291,180.65972,0,0,0,0,5.08,-0.001,-196.85; Symbol: 204-10SDRD/S530-A3/F182-68; Device: 204-10SDRD/S530-A3/F182-68; Manufacturer Part: 204-10SDRD/S530-A3/F182-68; LCSC Part Name: 204-10SDRD/S530-A3/F182-68; SupplierPart: C473831; Supplier Footprint: 插件; JLCPCB Part Class: Extended Part; Supplier: LCSC; ConvertToPcb: yes; FootprintName: LED-TH_BD4.0-P2.50-RD
U7 = LM2596S-5.0(UMW): 功能类型:降压型;工作电压:7V~40V;输出电压:5V;输出电流:3A;输出类型:固定;; Manufacturer: UMW(友台半导体); 3D Model: 4e421a816a7f4d57b8710832ddea550a聨0819f05c4eef4c71ace90d822a990e87; 3D Model Transform: 401.574,560.17797,0,90,0,0,-45.276,0,0; Function: 降压型; Voltage - Supply: 7V~40V; Output Voltage: 5V; Output Current: 3A; Frequency - Switching: 150kHz; Synchronous Rectifier: 否; Number of Outputs: 1; Topology: 降压式; Quiescent Current: 80uA; Switch tube (built-in/external): 内置; Output Type: 固定; AddInBom: yes; ModelName: TO-263-5-5P_L10.2-W8.7-H4.5-LS14.4-P1.70; Symbol: LM2596S-5.0; Device: LM2596S-5.0(UMW); LCSC Part Name: 3A降压稳压器; Supplier Part: C347421; Manufacturer Part: LM2596S-5.0(UMW); Supplier Footprint: TO-263-5; JLCPCB Part Class: Extended Part; Datasheet: https://item.szlcsc.com/datasheet/LM2596S-5.0(UMW)/324081.html; Supplier: LCSC; Operating Temperature: -40℃~+125℃@(TA); ConvertToPcb: yes; FootprintName: TO-263-5_L10.2-W8.9-P1.70-BR
U8 = ICL7660AIBAZA-T: ICL7660S和ICL7660A超级电压转换器是单片CMOS电压转换集成电路，与其他类似器件相比，具有显著的性能优势。; Manufacturer: RENESAS(瑞萨)/IDT; AddInBom: yes; ModelId: 7abc64c95a1a4a04a4ef38f9097c870b聨0819f05c4eef4c71ace90d822a990e87; ModelTransform: 192.913,236.22,0,0,0,0,0,0,0; Operating Voltage: 1.5V~12V; Quiescent Current: 100uA; Output Resistance: 97Ω; Energy Efficiency: 98%; Switching Frequency: 8kHz; Function: 反相; Output Voltage: -12V~-1.5V; Symbol: ICL7660AIBAZA-T; Device: ICL7660AIBAZA-T; LCSC Part Name: 超电压转换器; SupplierPart: C7881; ManufacturerPart: ICL7660AIBAZA-T; Supplier Footprint: SOIC-8; JLCPCB Part Class: Extended Part; Datasheet: https://item.szlcsc.com/datasheet/ICL7660AIBAZA-T/8358.html; Supplier: LCSC; ConvertToPcb: yes; FootprintName: SOIC-8_L5.0-W4.0-P1.27-LS6.0-BL; ModelName: SOIC-8_L5.0-W4.0-P1.27-LS6.0-BL; Operating Temperature: -40℃~+85℃
U10 = XT220UF50V90RV0078: 容值:220uF;精度:±20%;额定电压:50V;纹波电流:220mA@120Hz;等效串联电阻:-;; Manufacturer: KNSCHA(科尼盛); 3D Model: f80fb1ebdc5048aa863ddf4e69fa519f; 3D Model Transform: 429.133,405.511,0,180,0,0,0,0,0; Tolerance: ±20%; Rated Voltage: 50V; φD: 10mm; L: 10.5mm; Lifetime @ Temp: 2000hrs@105℃; AddInBom: yes; Symbol: xt220uf50v90rv0078; Device: XT220UF50V90RV0078; LCSC Part Name: 220uF ±20% 50V; Supplier Part: C2992609; Manufacturer Part: XT220UF50V90RV0078; Supplier Footprint: SMD,D10xL10.5mm; JLCPCB Part Class: 扩展库; Datasheet: https://atta.szlcsc.com/upload/public/pdf/source/20220628/63A0162D3C346C4A55B6B1AC78D14202.pdf; Supplier: LCSC; Value: 220uF; Ripple Current: 220mA@120Hz; Equivalent Series Resistance(ESR): -; Operating Temperature: -55℃~+105℃; ConvertToPcb: yes; FootprintName: CAP-SMD_BD10.0-L10.3-W10.3-LS11.3-FD; ModelName: CAP-SMD_BD10.0-L10.3-W10.3-LS11.3-FD
U11 = NE555DR_C7593: NE555 单精度定时器; Manufacturer: TI(德州仪器); AddInBom: yes; ModelId: e81d2f7d937b4a6ab1dca543ff5d56a4聨0819f05c4eef4c71ace90d822a990e87; ModelName: SOIC-8_L4.9-W3.9-H1.7-LS6.0-P1.27; ModelTransform: 192.913,236.22,0,0,0,0,0,0,0; Symbol: NE555DR; Device: NE555DR_C7593; LCSC Part Name: NE555DR; SupplierPart: C7593; ManufacturerPart: NE555DR; Supplier Footprint: SOIC-8; JLCPCB Part Class: Extended Part; Datasheet: https://www.ti.com/cn/lit/gpn/sa555; Supplier: LCSC; ConvertToPcb: yes; FootprintName: SOIC-8_L4.9-W3.9-P1.27-LS6.0-BL
U12 U14 = LM311N: 比较器数:单路;输入失调电压(Vos):7.5mV;输入偏置电流(Ib):250nA;; Manufacturer: HGSEMI(华冠); AddInBom: yes; ModelId: db2af726fcec488f8bf8e467aca974b3聨0819f05c4eef4c71ace90d822a990e87; ModelName: DIP-8_L9.8-W6.6-H3.5-LS7.62-P2.54; ModelTransform: 385.826,311.8104,0,0,0,0,-1.693,0,-137.795; Number of Channels: 单路; Vos - Input Offset Voltage: 7.5mV; Ib - Input Bias Current: 250nA; Propagation Delay Time: 300ns; Quiescent Current: 7.5mA; Maximum Power Supply Range (Vdd-Vss): 36V; Dual Supply: ±15V; Input Offset Current(Ios): 50nA; Symbol: LM311N; Device: LM311N; LCSC Part Name: 高性能电压比较器; SupplierPart: C434572; ManufacturerPart: LM311N; Supplier Footprint: DIP-8; JLCPCB Part Class: Extended Part; Datasheet: https://item.szlcsc.com/datasheet/LM311N/431665.html; Supplier: LCSC; ConvertToPcb: yes; FootprintName: DIP-8_L9.8-W6.6-P2.54-LS7.6-BL; Common Mode Rejection Ratio(CMRR): -; Output Type: -; Operating Temperature: -45℃~+85℃
U13 = LF411CP: 增益带宽积(GBP):3MHz;输入偏置电流(Ib):50pA;输入失调电压(Vos):800uV;压摆率(SR):13V/us;; Manufacturer: TI(德州仪器); AddInBom: yes; ModelId: 28221afe73f64733a5f69edf09cc8200聨0819f05c4eef4c71ace90d822a990e87; ModelTransform: 366.141,322.834,0,0,0,0,0,0,-118.11; Gain Bandwidth Product(GBP): 3MHz; Current - Input Bias(Ib): 50pA; Voltage - Input Offset(Vos): 800uV; Slew Rate(SR): 13V/us; Symbol: LF411CP; Device: LF411CP; LCSC Part Name: LF411CP; SupplierPart: C1346062; ManufacturerPart: LF411CP; Supplier Footprint: PDIP-8; JLCPCB Part Class: Extended Part; Datasheet: https://www.ti.com/cn/lit/gpn/lf411; Supplier: LCSC; ConvertToPcb: yes; FootprintName: PDIP-8_L9.3-W6.4-P2.54-LS7.9-BL-1; ModelName: PDIP-8_L9.3-W6.4-P2.54-LS7.9-BL-1; Operating Temperature: 0℃~+70℃
U15 = L6203: DMOS全桥驱动器; Manufacturer: ST(意法半导体); AddInBom: yes; ModelId: da60a49ab25c4601b1424b0128f833b3聨0819f05c4eef4c71ace90d822a990e87; ModelTransform: 771.652,383.8575,0,0,0,0,0,86.614,-118.11; Output Current: 4A; Peak Current: 5A; Voltage - Supply: 12V~48V; RDS(on): 300mΩ; Quiescent Current(Iq): 15mA; Symbol: L6203; Device: L6203; LCSC Part Name: 48V电机驱动芯片; SupplierPart: C34306; ManufacturerPart: L6203; Supplier Footprint: Multiwatt-11-V; JLCPCB Part Class: Extended Part; Datasheet: https://item.szlcsc.com/datasheet/L6203/35274.html; Supplier: LCSC; ConvertToPcb: yes; FootprintName: MULTIWATT-11V_L19.6-W5.0-P1.70-L; ModelName: MULTIWATT-11V_L19.6-W5.0-P1.70-L; Technology: 是; Number of H-bridges: -; Interface: -; Operating Temperature: -